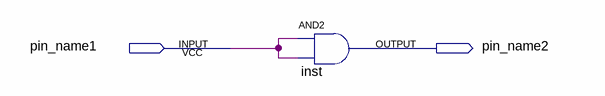
[diagram p0: schematic sheet]
// Quartus schematic processador_mips.bdf as structural Verilog: 1 symbols, 2 pins
module processador_mips (
  input  pin_name1,
  output pin_name2
);

  and inst (pin_name2, pin_name1, pin_name1);
endmodule
